# Altium project Flight_Controller_Board_Design.PrjPcb
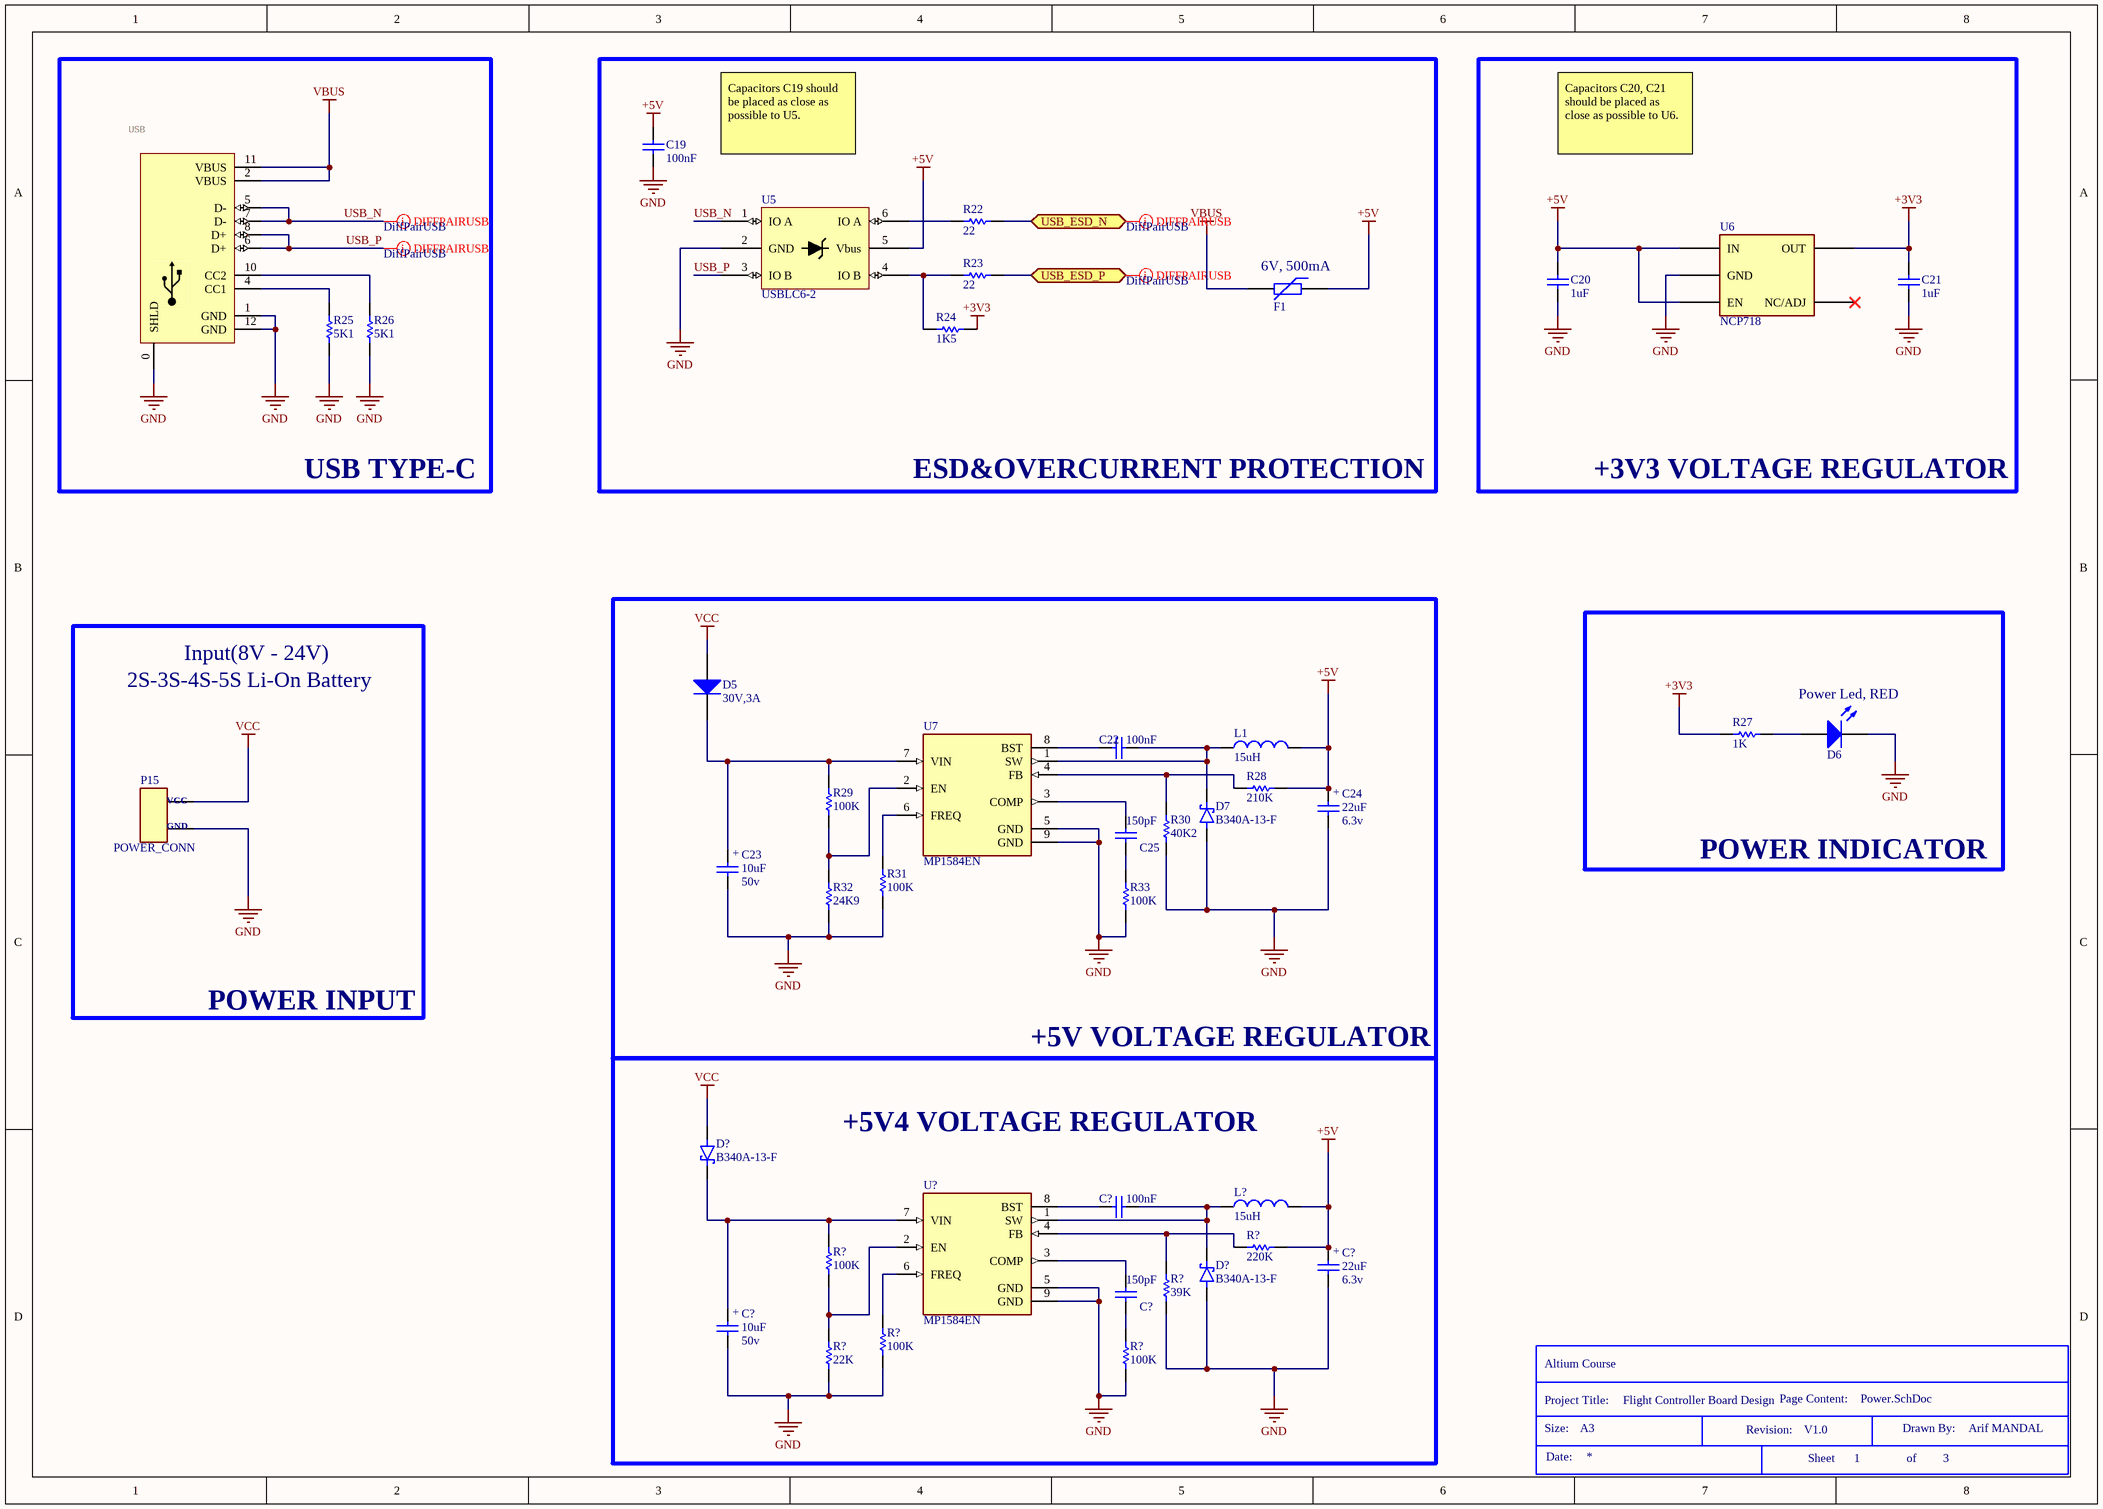
[diagram p0: Power.SchDoc]
NameProject: Flight Controller Board Design
3 sheets, 112 parts. Net scope: flat (ports and power ports of the same name join across sheets).
Board file: Flight_Controller_Board_Design.PcbDoc
Sheets:
  Power.SchDoc
  MicroController.SchDoc
  Modules.SchDoc

## Sheet Power.SchDoc
size A3; DocumentNumber: 1; Revision: V1.0; SheetNumber: 1; SheetTotal: 3

### Parts
(Parts that share a designator on the sheet are numbered #1, #2 ... from top to bottom, then left to right.)
*#1  Size: A3  Drawn By: Arif MANDAL  (hidden comment: Title Block)  (graphical)
C19  100nF  [C805]
C20  1uF  [C805]
C21  1uF  [C805]
C22  100nF  [C805]
C23  Volte: 50v  [MY_SMC_A]  (hidden comment: 10uF)
C24  Volte: 6.3v  [MY_SMC_A]  (hidden comment: 22uF)
C25  150pF  [C805]
C?#1  100nF  [C805]
C?#2  Volte: 6.3v  [MY_SMC_A]  (hidden comment: 22uF)
C?#3  150pF  [C805]
C?#4  Volte: 50v  [MY_SMC_A]  (hidden comment: 10uF)
D5  30V,3A  [MY_1N4007_SMD]
D6  LED  [LED-1206]  (value not drawn)
D7  B340A-13-F  [DIOM5226X240N]
D?#1  B340A-13-F  [DIOM5226X240N]
D?#2  B340A-13-F  [DIOM5226X240N]
F1  500mA  [PTC-0805]  (value not drawn)
L1  15uH  [MY_DR73]
L?  15uH  [MY_DR73]
P15  POWER_CONN  [POWER_CONN]
R22  22  [R805]
R23  22  [R805]
R24  1K5  [R805]
R25  5K1  [R805]
R26  5K1  [R805]
R27  1K  [R805]
R28  210K  [R805]
R29  100K  [R805]
R30  40K2  [R805]
R31  100K  [R805]
R32  24K9  [R805]
R33  100K  [R805]
R?#1  220K  [R805]
R?#2  39K  [R805]
R?#3  100K  [R805]
R?#4  100K  [R805]
R?#5  22K  [R805]
R?#6  100K  [R805]
U5  USBLC6-2  [SOT-23-6]
U6  NCP718  [TSOT-23-5]
U7  MP1584EN  [SOIC127P-9N]
U?  MP1584EN  [SOIC127P-9N]
USB  USB_C  [USB-C-5]  (value not drawn)

### Blocks framed on the sheet
USB TYPE-C: R25 R26 USB
ESD&OVERCURRENT PROTECTION: C19 F1 R22-R24 U5
+3V3 VOLTAGE REGULATOR: C20 C21 U6
+5V VOLTAGE REGULATOR: C22-C25 D5 D7 L1 R28-R33 U7
POWER INPUT: P15
POWER INDICATOR: D6 R27

### Ports
USB_ESD_N (bidir), USB_ESD_P (bidir)

### Nets
+3V3: C21.2 R24.2 R27.1 U6.5(OUT)
+5V: C19.2 C20.2 C24.+ C?#2.+ F1.1 L1.2 L?.2 R28.1 R?#1.1 U5.5(Vbus) U6.1(IN) U6.3(EN)
GND: C19.1 C20.1 C21.1 C23.- C24.- C?#2.- C?#4.- D6.2(K) D7.A D?#2.A P15.1(GND) R25.1 R26.1 R30.2 R31.1 R32.1 R33.1 R?#2.2 R?#4.1 R?#5.1 R?#6.1 U5.2(GND) U6.2(GND) U7.5(GND) U7.9(GND) U?.5(GND) U?.9(GND) USB.0(SHLD) USB.1(GND) USB.12(GND)
VBUS: F1.2 USB.2(VBUS) USB.11(VBUS)
VCC: D5.A D?#1.A P15.0(VCC)
USB_N: U5.1(IO_A) USB.5(D-) USB.7(D-)
USB_P: U5.3(IO_B) USB.6(D+) USB.8(D+)
NetC22_1: C22.1 D7.C L1.1 U7.1(SW)
NetC22_2: C22.2 U7.8(BST)
NetC23_+: C23.+ D5.K R29.2 U7.7(VIN)
NetC25_1: C25.1 R33.2
NetC25_2: C25.2 U7.3(COMP)
NetC?#1_1: C?#1.1 D?#2.C L?.1 U?.1(SW)
NetC?#1_2: C?#1.2 U?.8(BST)
NetC?#3_1: C?#3.1 R?#6.2
NetC?#3_2: C?#3.2 U?.3(COMP)
NetC?#4_+: C?#4.+ D?#1.C R?#3.2 U?.7(VIN)
NetD6_1: D6.1(A) R27.2
NetR22_1: R22.1 ; port USB_ESD_N
NetR22_2: R22.2 U5.6(IO_A)
NetR23_1: R23.1 ; port USB_ESD_P
NetR23_2: R23.2 R24.1 U5.4(IO_B)
NetR25_2: R25.2 USB.4(CC1)
NetR26_2: R26.2 USB.10(CC2)
NetR28_2: R28.2 R30.1 U7.4(FB)
NetR29_1: R29.1 R32.2 U7.2(EN)
NetR31_2: R31.2 U7.6(FREQ)
NetR?#1_2: R?#1.2 R?#2.1 U?.4(FB)
NetR?#3_1: R?#3.1 R?#5.2 U?.2(EN)
NetR?#4_2: R?#4.2 U?.6(FREQ)

Not connected (* = marked no-connect by the designer): U6 4(NC/ADJ)*

### Layout directives
differential pair; differential pair class DiffPairUSB: NetR22_1, NetR23_1, USB_N, USB_P

### Notes on the sheet
- Capacitors C19 should be placed as close as possible to U5.
- Capacitors C20, C21 should be placed as close as possible to U6.
- (near F1) 6V, 500mA
- 2S-3S-4S-5S Li-On Battery
- Input(8V - 24V)
- Power Led, RED
- +5V4 VOLTAGE REGULATOR
- (in symbol Title Block) Altium Course; Project Title:; Page Content:; Size:; Revision:; Drawn By:; Date:; Sheet; of

### Library data of the parts
C19-C22 C25 C?#1 C?#3 = Cap: Capacitor; Designer: Parsa Malekpour
  C19 C22 C?#1: Value: 100nF
  C20 C21: Value: 1uF
  C25 C?#3: Value: 150pF
C23 C24 C?#2 C?#4 = Cap Pol: Polar capacitor; ASiD Part Number: C-AS
  C23 C?#4: Value: 10uF
  C24 C?#2: Value: 22uF
D5 = 1N4007: 1 Amp Diode; ASiD Part Number: 1n4007-AS
D7 D?#1 D?#2 = B340A-13-F: Diode, Rectifier, 3a, 40v, Do-214ac, Full Reel; Price: None; Value: *; MP: B340A-13-F; Package: None; Availability: Unavailable
F1 = PTC: Published: 24-Mar-1999; PackageVersion: Mar-2003; PackageReference: 6-0805
L1 L? = Inductor: ASiD Part Number: Inductor-AS; Current: 3.75A; Value: 15uH
P15 = POWER_CONN: Li-on Battery Power Connector
R22-R33 R?#1-R?#6 = Resistor: Designer: Parsa Malekpour
  R22 R23: Value: 22
  R24: Value: 1K5
  R25 R26: Value: 5K1
  R27: Value: 1K
  R28: Value: 210K
  R29 R31 R33 R?#3 R?#4 R?#6: Value: 100K
  R30: Value: 40K2
  R32: Value: 24K9
  R?#1: Value: 220K
  R?#2: Value: 39K
  R?#5: Value: 22K
U5 = USBLC6-2: Very low capacitance ESD protection
U6 = NCP718: Linear Voltage Regulator IC Positive Fixed 1 Output 300mA TSOT-23-5; Manu. Product Num.: NCP718BSN330T1G
U7 U? = MP1584EN: Buck Switching Regulator IC Positive Adjustable 0.8V 1 Output 3A 8-SOIC (0.154, 3.90mm Width) Exposed Pad; MF: Monolithic Power; Value: *; SnapEDA_Link: https://www.snapeda.com/parts/MP1584EN/Monolithic+Power+Systems+Inc./view-part/?ref=snap; MP: MP1584EN; Purchase-URL: https://pricing.snapeda.com/search/part/MP1584EN/?ref=eda; Check_prices: https://www.snapeda.com/parts/MP1584EN/Monolithic+Power+Systems+Inc./view-part/?ref=eda; Availability: In Stock; Price: None; Package: SOIC-8 Monolithic Power
USB = USB_C: USB Type C 16Pin Connector Super Speed pins not available on the 16-pin purely SMD connector so this part is best for USB 2.0 implementations. D1 and D2 are tied together enabling D+/- no matter which way the cable is plugged into the connector. The two channel configuration pins (CC1/2) are exposed. These are normally connected to ground via 5.1k resistors but can be reconfigured for high current/high power applications.; GateName_1: J1; SymbolName_1: USB-C-MINIMUM; DeviceName: 5; LibraryName: USBC; DeviceSetName: USB_C

## Sheet MicroController.SchDoc
size A3; DocumentNumber: 2; Revision: V1.0; SheetNumber: 2; SheetTotal: 3
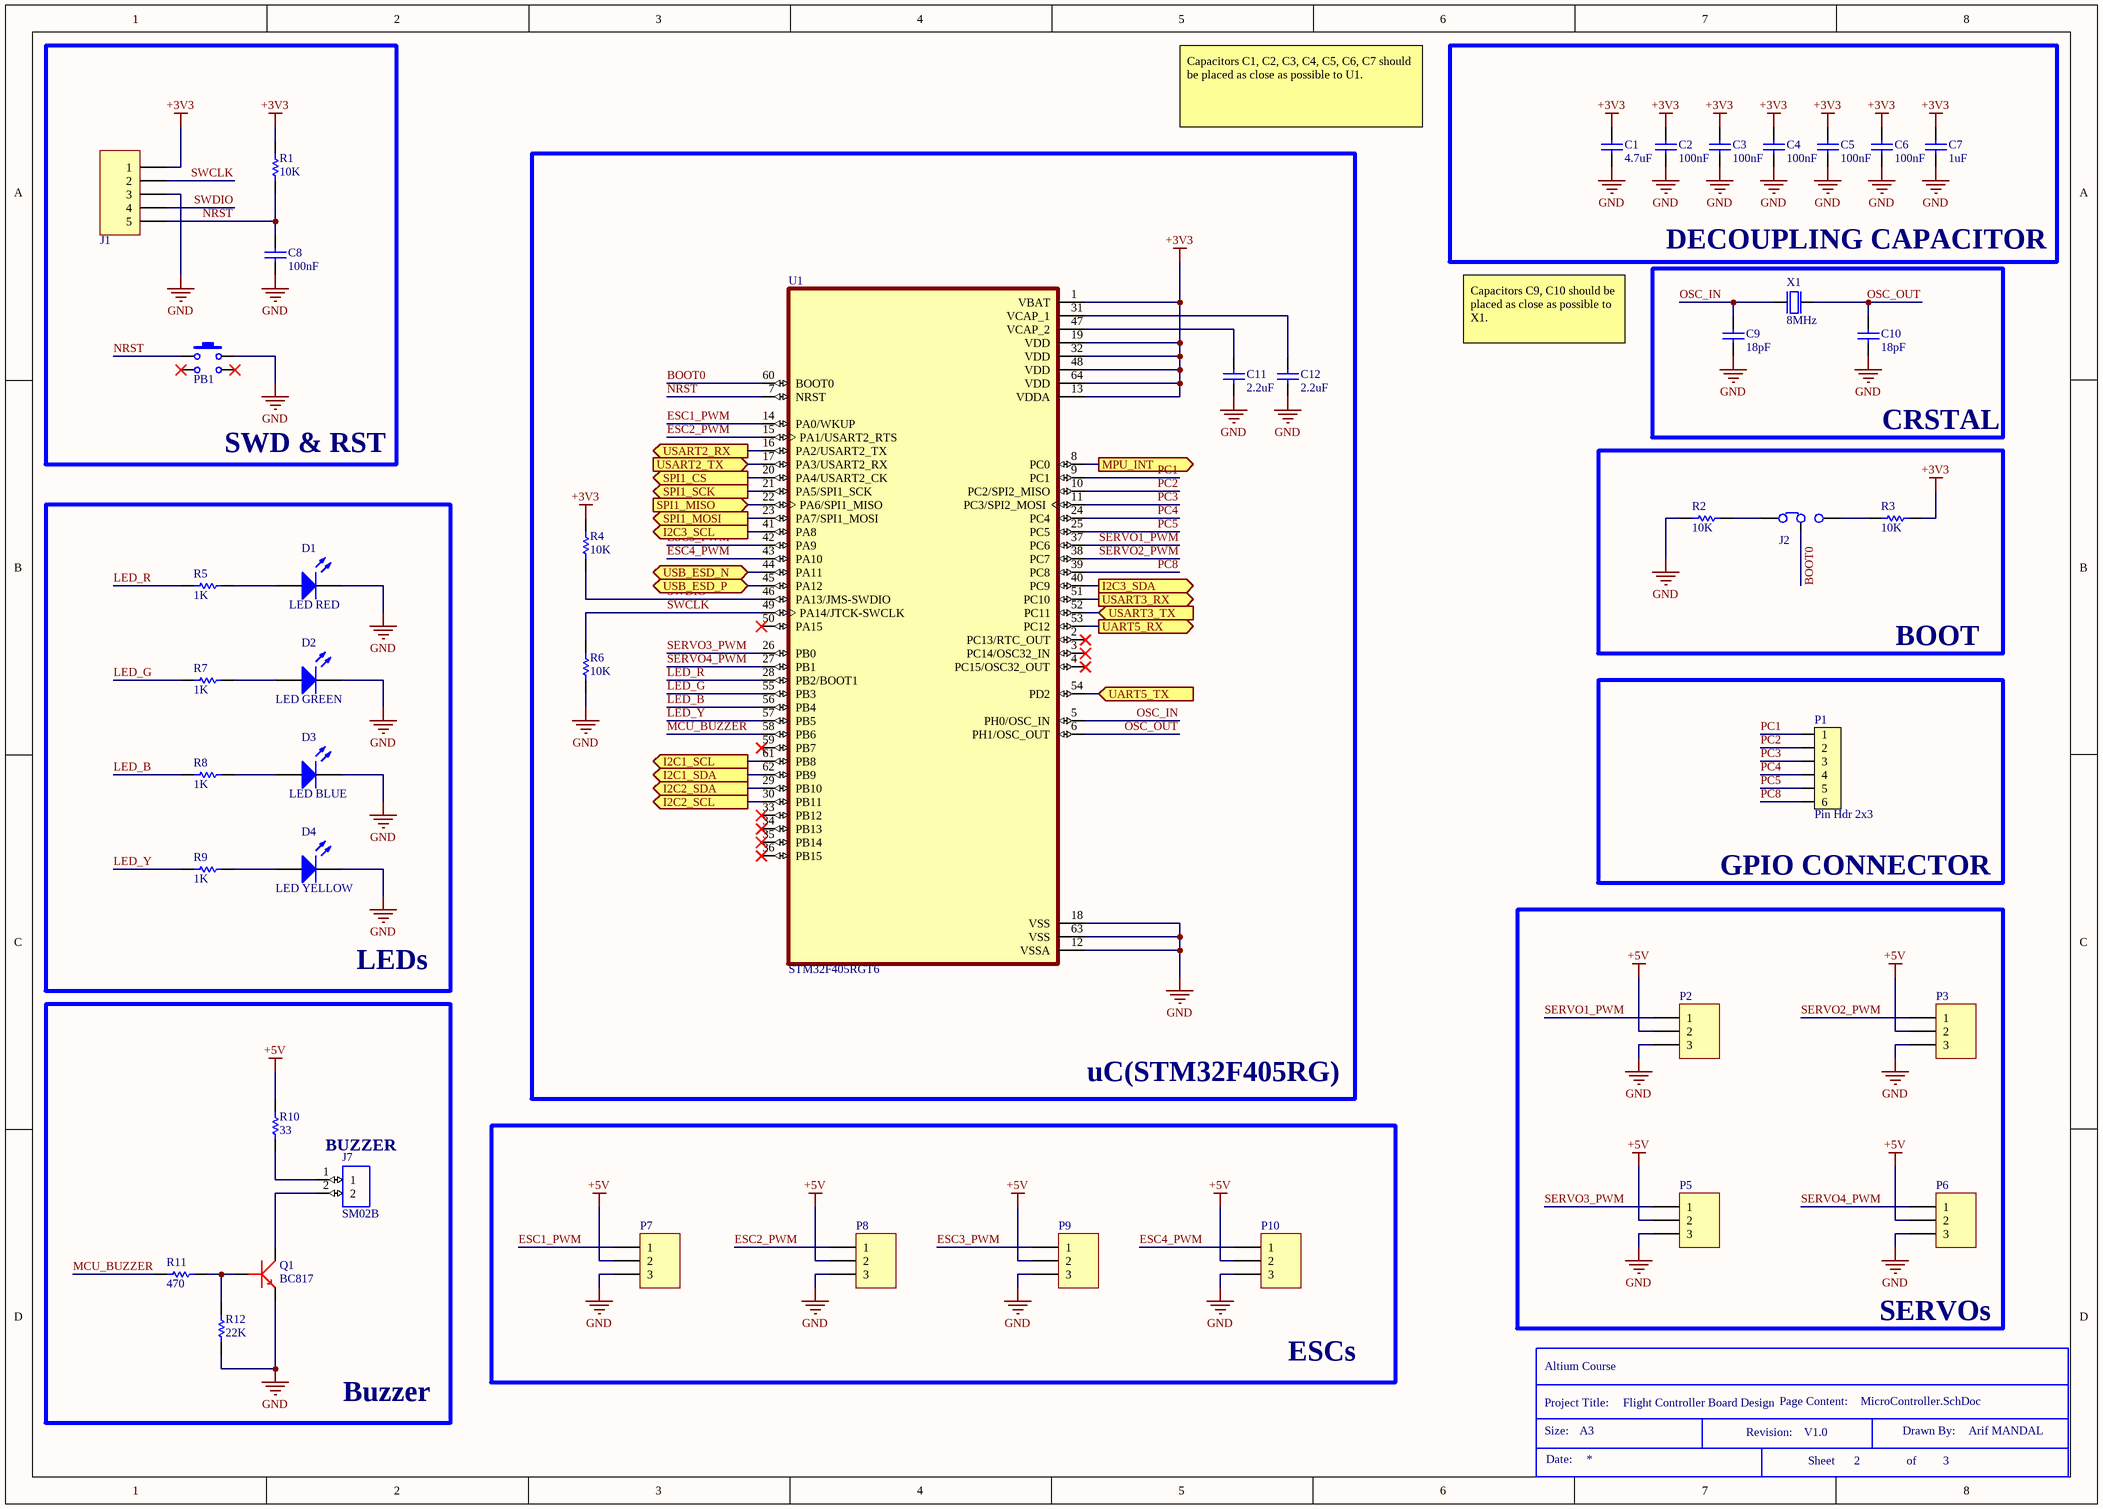
[diagram p1: MicroController.SchDoc]

### Parts
(Parts that share a designator on the sheet are numbered #1, #2 ... from top to bottom, then left to right.)
*#2  Size: A3  Drawn By: Arif MANDAL  (hidden comment: Title Block)  (graphical)
C1  4.7uF  [C805]
C2  100nF  [C805]
C3  100nF  [C805]
C4  100nF  [C805]
C5  100nF  [C805]
C6  100nF  [C805]
C7  1uF  [C805]
C8  100nF  [C805]
C9  18pF  [C805]
C10  18pF  [C805]
C11  2.2uF  [C805]
C12  2.2uF  [C805]
D1  LED RED  [MY_LED_0805]
D2  LED GREEN  [MY_LED_0805]
D3  LED BLUE  [MY_LED_0805]
D4  LED YELLOW  [MY_LED_0805]
J1  CONN-5  [PHDR5]  (value not drawn)
J2  jumper  [jumper-3]  (value not drawn)
J7  SM02B  [SM02B-SRSS-TB(LF)(SN)]
P1  Pin Hdr 2x3  [HDR_2x3-SMD]
P2  Header 3  [My_1X03]  (value not drawn)
P3  Header 3  [My_1X03]  (value not drawn)
P5  Header 3  [My_1X03]  (value not drawn)
P6  Header 3  [My_1X03]  (value not drawn)
P7  Header 3  [My_1X03]  (value not drawn)
P8  Header 3  [My_1X03]  (value not drawn)
P9  Header 3  [My_1X03]  (value not drawn)
P10  Header 3  [My_1X03]  (value not drawn)
PB1  Push Button  [PB-SMD-3]  (value not drawn)
Q1  BC817  [SOT23_3]
R1  10K  [R805]
R2  10K  [R805]
R3  10K  [R805]
R4  10K  [R805]
R5  1K  [R805]
R6  10K  [R805]
R7  1K  [R805]
R8  1K  [R805]
R9  1K  [R805]
R10  33  [R805]
R11  470  [R805]
R12  22K  [R805]
U1  STM32F405RGT6  [QFP-64N]
X1  8MHz  [BT-XTAL_2016]

### Blocks framed on the sheet
SWD & RST: C8 J1 PB1 R1
DECOUPLING CAPACITOR: C1-C7
uC(STM32F405RG): C11 C12 R4 R6 U1
LEDs: D1-D4 R5 R7-R9
GPIO CONNECTOR: P1
SERVOs: P2 P3 P5 P6
Buzzer: J7 Q1 R10-R12
ESCs: P7-P10

### Ports
I2C1_SCL (out), I2C1_SDA (out), I2C2_SCL (out), I2C2_SDA (out), I2C3_SCL (out), I2C3_SDA (out), MPU_INT (out), SPI1_CS (out), SPI1_MISO (in), SPI1_MOSI (out), SPI1_SCK (out), UART5_RX (out), UART5_TX (in), USART2_RX (out), USART2_TX (in), USART3_RX (out), USART3_TX (in), USB_ESD_N (bidir), USB_ESD_P (bidir)

### Nets
+3V3: C1.2 C2.2 C3.2 C4.2 C5.2 C6.2 C7.2 J1.1 R1.2 R3.1 R4.2 U1.1(VBAT) U1.13(VDDA) U1.19(VDD) U1.32(VDD) U1.48(VDD) U1.64(VDD)
+5V: P2.2 P3.2 P5.2 P6.2 P7.2 P8.2 P9.2 P10.2 R10.1
GND: C1.1 C2.1 C3.1 C4.1 C5.1 C6.1 C7.1 C8.1 C9.1 C10.1 C11.1 C12.1 D1.K D2.K D3.K D4.K J1.3 P2.3 P3.3 P5.3 P6.3 P7.3 P8.3 P9.3 P10.3 PB1.2 Q1.2(E) R2.2 R6.1 R12.2 U1.12(VSSA) U1.18(VSS) U1.63(VSS) X1.2(GND) X1.4(GND)
BOOT0: J2.2(C2) U1.60(BOOT0)
ESC1_PWM: P7.1 U1.14(PA0/WKUP)
ESC2_PWM: P8.1 U1.15(PA1/USART2_RTS)
ESC3_PWM: P9.1 U1.42(PA9)
ESC4_PWM: P10.1 U1.43(PA10)
LED_B: R8.2 U1.56(PB4)
LED_G: R7.2 U1.55(PB3)
LED_R: R5.2 U1.28(PB2/BOOT1)
LED_Y: R9.2 U1.57(PB5)
MCU_BUZZER: R11.2 U1.58(PB6)
NRST: C8.2 J1.5 PB1.1 R1.1 U1.7(NRST)
OSC_IN: C9.2 U1.5(PH0/OSC_IN) X1.1(inp)
OSC_OUT: C10.2 U1.6(PH1/OSC_OUT) X1.3(out)
PC1: P1.1 U1.9(PC1)
PC2: P1.2 U1.10(PC2/SPI2_MISO)
PC3: P1.3 U1.11(PC3/SPI2_MOSI)
PC4: P1.4 U1.24(PC4)
PC5: P1.5 U1.25(PC5)
PC8: P1.6 U1.39(PC8)
SERVO1_PWM: P2.1 U1.37(PC6)
SERVO2_PWM: P3.1 U1.38(PC7)
SERVO3_PWM: P5.1 U1.26(PB0)
SERVO4_PWM: P6.1 U1.27(PB1)
SWCLK: J1.2 R6.2 U1.49(PA14/JTCK-SWCLK)
SWDIO: J1.4 R4.1 U1.46(PA13/JMS-SWDIO)
NetC11_2: C11.2 U1.47(VCAP_2)
NetC12_2: C12.2 U1.31(VCAP_1)
NetD1_A: D1.A R5.1
NetD2_A: D2.A R7.1
NetD3_A: D3.A R8.1
NetD4_A: D4.A R9.1
NetJ2_1: J2.1(C1) R2.1
NetJ2_3: J2.3(C3) R3.2
NetJ3_2: U1.17(PA3/USART2_RX) ; port USART2_TX
NetJ3_3: U1.16(PA2/USART2_TX) ; port USART2_RX
NetJ4_2: U1.52(PC11) ; port USART3_TX
NetJ4_3: U1.51(PC10) ; port USART3_RX
NetJ5_2: U1.54(PD2) ; port UART5_TX
NetJ5_3: U1.53(PC12) ; port UART5_RX
NetJ6_2: U1.40(PC9) ; port I2C3_SDA
NetJ6_3: U1.41(PA8) ; port I2C3_SCL
NetJ7_1: J7.1 R10.2
NetJ7_2: J7.2 Q1.3(C)
NetQ1_1: Q1.1(B) R11.1 R12.1
NetR13_1: U1.62(PB9) ; port I2C1_SDA
NetR14_1: U1.61(PB8) ; port I2C1_SCL
NetR15_1: U1.29(PB10) ; port I2C2_SDA
NetR16_1: U1.30(PB11) ; port I2C2_SCL
NetR22_1: U1.44(PA11) ; port USB_ESD_N
NetR23_1: U1.45(PA12) ; port USB_ESD_P
NetU1_8: U1.8(PC0) ; port MPU_INT
NetU1_20: U1.20(PA4/USART2_CK) ; port SPI1_CS
NetU1_21: U1.21(PA5/SPI1_SCK) ; port SPI1_SCK
NetU1_22: U1.22(PA6/SPI1_MISO) ; port SPI1_MISO
NetU1_23: U1.23(PA7/SPI1_MOSI) ; port SPI1_MOSI

Not connected (* = marked no-connect by the designer): PB1 3* 4*; U1 2(PC13/RTC_OUT)* 3(PC14/OSC32_IN)* 4(PC15/OSC32_OUT)* 33(PB12)* 34(PB13)* 35(PB14)* 36(PB15)* 50(PA15)* 59(PB7)*

### Notes on the sheet
- Capacitors C1, C2, C3, C4, C5, C6, C7 should be placed as close as possible to U1.
- Capacitors C9, C10 should be placed as close as possible to X1.
- CRSTAL
- BOOT
- (near J7) BUZZER
- (in symbol Title Block) Altium Course; Project Title:; Page Content:; Size:; Drawn By:; Revision:; Date:; Sheet; of

### Library data of the parts
C1-C12 = Cap: Capacitor; Designer: Parsa Malekpour
  C1: Value: 4.7uF
  C2-C6 C8: Value: 100nF
  C7: Value: 1uF
  C9 C10: Value: 18pF
  C11 C12: Value: 2.2uF
D1-D4 = LED: Typical INFRARED GaAs LED; ASiD Part Number: LED-AS
J2 = Triple Jumper: Jumper wire
J7 = SM02B-SRSS-TB(LF)(SN): Connector Header Surface Mount, Right Angle 2 position 0.039 _1.00mm_; MP: SM02B-SRSS-TB_LF__SN_; MF: JST Sales; SnapEDA_Link: https://www.snapeda.com/parts/SM02B-SRSS-TB%28LF%29%28SN%29/JST%20Sales%20America%20Inc./view-part/447499/?ref=snap; Price: None; Value: *; Availability: Unavailable; Package: None
P1 = Pin Header 2x3 SMD: Pin Header 2x3, 2.54mm (100mil) SMD; Manufacturer: W-CON; Manufacturer Part Number: 1125-1203S0M116R1; Part number IPS: 00000009966; Artikkelnr Noca: 55010007; Pad Count: 6; Part Number: Pin Header 2x3 SMD; Footprint Doc: HDR_2x3-SMD; LatestRevisionDate: 2016-01-22; Published: 2016-01-22; Value: Pin Hdr 2x3; Note: SMD; ComponentLink1URL: N.A.; ComponentLink1Description: Datasheet; ComponentLink2URL: N.A.; ComponentLink2Description: Supplier link; HelpURL: \\hizz\pro\app9717\Datasheet\connectors\W-CON\1125-12XXXXMXXXXX.PDF; Supplier 1: Cabcon; Supplier Part Number 1: 1125-1203S0M116R1; Supplier 2: Samtec; Supplier Part Number 2: TSM-103-01-L-DV; Component Class: Connectors; PartId: 100500242
P2 P3 P5-P10 = Header 3: Header, 3-Pin; ASiD Part Number: Header 3-AS
PB1 = SWITCH-PB
Q1 = bc817-16
R1-R12 = Resistor: Designer: Parsa Malekpour
  R1-R4 R6: Value: 10K
  R5 R7-R9: Value: 1K
  R10: Value: 33
  R11: Value: 470
  R12: Value: 22K
U1 = STM32F405RGT6: High-performance foundation line, ARM Cortex-M4 core with DSP and FPU, 1 Mbyte Flash, 168 MHz CPU, ART Accelerator; MP: STM32F405RGT6; Value: *; Purchase Link: https://ozdisan.com/Product/Detail/492033/STM32F405RGT6V; Package: 64LQFP; Availability: Unavailable
X1 = XTAL_SMD2016_32MHz_8pF_Golledge: XTAL SMD 2016, 32MHz, Cl=8pF, Tol: ±10ppm, Stab: ±15ppm; Manufacturer Part Number: MP06003; Part number IPS: 00000001431; Note: XTAL SMD 32.000MHz; Artikkelnr Noca: 22010050; Pad Count: 4; Part Number: XTAL_SMD2016_32MHz_8pF_Golledge; LatestRevisionDate: 2016-11-02; Published: 2016-11-02; Value: 8MHz; Footprint Doc: XTAL_2016; Manufacturer: Golledge; ComponentLink1URL: N.A.; ComponentLink1Description: Datasheet; ComponentLink2URL: N.A.; ComponentLink2Description: Supplier link; HelpURL: \\hizz\pro\app9717\Datasheet\crystals\Golledge\mp06003.pdf; Supplier 1: Link Nordic; Supplier Part Number 1: N.A.; Supplier 2: N.A.; Supplier Part Number 2: N.A.; Component Class: Oscillators; PartId: 101600041

## Sheet Modules.SchDoc
size A3; DocumentNumber: 3; Revision: V1.0; SheetNumber: 3; SheetTotal: 3
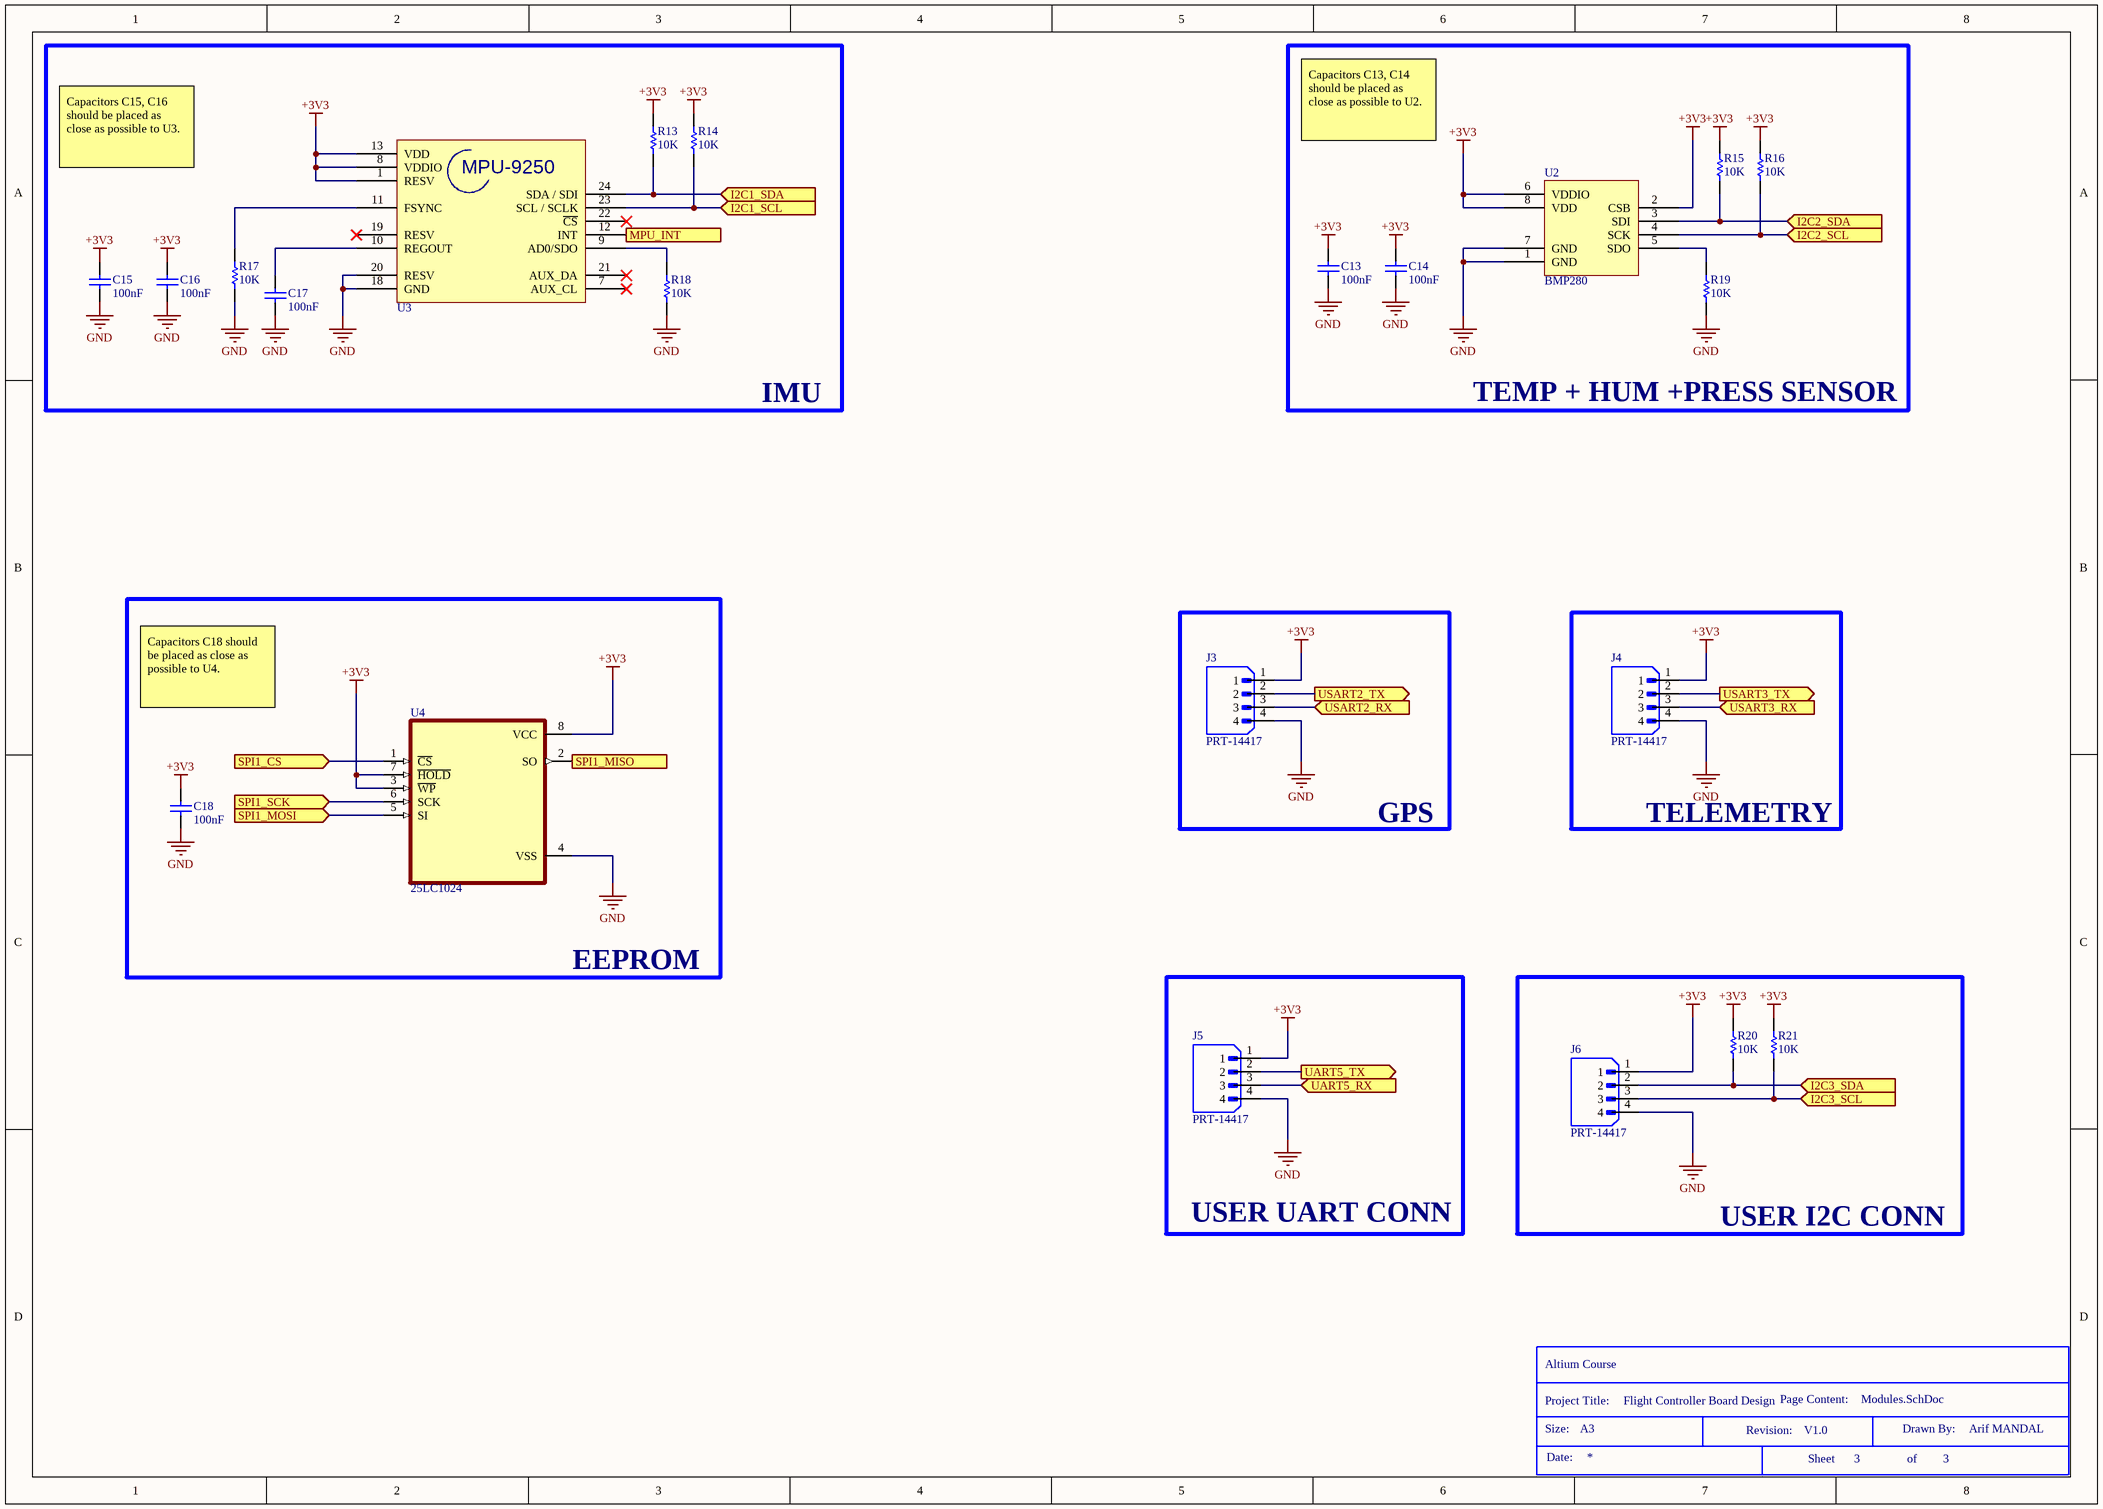
[diagram p2: Modules.SchDoc]

### Parts
(Parts that share a designator on the sheet are numbered #1, #2 ... from top to bottom, then left to right.)
*#3  Size: A3  Drawn By: Arif MANDAL  (hidden comment: Title Block)  (graphical)
C13  100nF  [C805]
C14  100nF  [C805]
C15  100nF  [C805]
C16  100nF  [C805]
C17  100nF  [C805]
C18  100nF  [C805]
J3  PRT-14417  [SPARKFUN_PRT-14417]
J4  PRT-14417  [SPARKFUN_PRT-14417]
J5  PRT-14417  [SPARKFUN_PRT-14417]
J6  PRT-14417  [SPARKFUN_PRT-14417]
R13  10K  [R805]
R14  10K  [R805]
R15  10K  [R805]
R16  10K  [R805]
R17  10K  [R805]
R18  10K  [R805]
R19  10K  [R805]
R20  10K  [R805]
R21  10K  [R805]
U2  BMP280  [BMP280]
U3  MPU-9250  [QFN-24]  (value not drawn)
U4  25LC1024  [SOIC-8N]

### Blocks framed on the sheet
IMU: C15-C17 R13 R14 R17 R18 U3
TEMP + HUM +PRESS SENSOR: C13 C14 R15 R16 R19 U2
EEPROM: C18 U4
GPS: J3
TELEMETRY: J4
USER UART CONN: J5
USER I2C CONN: J6 R20 R21

### Ports
I2C1_SCL (in), I2C1_SDA (in), I2C2_SCL (in), I2C2_SDA (in), I2C3_SCL (in), I2C3_SDA (in), MPU_INT (in), SPI1_CS (in), SPI1_MISO (out), SPI1_MOSI (in), SPI1_SCK (in), UART5_RX (in), UART5_TX (out), USART2_RX (in), USART2_TX (out), USART3_RX (in), USART3_TX (out)

### Nets
+3V3: C13.2 C14.2 C15.2 C16.2 C18.2 J3.1 J4.1 J5.1 J6.1 R13.2 R14.2 R15.2 R16.2 R20.2 R21.2 U2.2(CSB) U2.6(VDDIO) U2.8(VDD) U3.1(RESV) U3.8(VDDIO) U3.13(VDD) U4.3(~{WP}) U4.7(~{HOLD}) U4.8(VCC)
GND: C13.1 C14.1 C15.1 C16.1 C17.1 C18.1 J3.4 J4.4 J5.4 J6.4 R17.1 R18.1 R19.1 U2.1(GND) U2.7(GND) U3.18(GND) U3.20(RESV) U4.4(VSS)
NetC17_2: C17.2 U3.10(REGOUT)
NetJ3_2: J3.2 ; port USART2_TX
NetJ3_3: J3.3 ; port USART2_RX
NetJ4_2: J4.2 ; port USART3_TX
NetJ4_3: J4.3 ; port USART3_RX
NetJ5_2: J5.2 ; port UART5_TX
NetJ5_3: J5.3 ; port UART5_RX
NetJ6_2: J6.2 R20.1 ; port I2C3_SDA
NetJ6_3: J6.3 R21.1 ; port I2C3_SCL
NetR13_1: R13.1 U3.24(SDA_/_SDI) ; port I2C1_SDA
NetR14_1: R14.1 U3.23(SCL_/_SCLK) ; port I2C1_SCL
NetR15_1: R15.1 U2.3(SDI) ; port I2C2_SDA
NetR16_1: R16.1 U2.4(SCK) ; port I2C2_SCL
NetR17_2: R17.2 U3.11(FSYNC)
NetR18_2: R18.2 U3.9(AD0/SDO)
NetR19_2: R19.2 U2.5(SDO)
NetU1_8: U3.12(INT) ; port MPU_INT
NetU1_20: U4.1(~{CS}) ; port SPI1_CS
NetU1_21: U4.6(SCK) ; port SPI1_SCK
NetU1_22: U4.2(SO) ; port SPI1_MISO
NetU1_23: U4.5(SI) ; port SPI1_MOSI

Not connected (* = marked no-connect by the designer): U3 7(AUX_CL)* 19(RESV)* 21(AUX_DA)* 22(~{CS})*

### Notes on the sheet
- Capacitors C15, C16 should be placed as close as possible to U3.
- Capacitors C13, C14 should be placed as close as possible to U2.
- Capacitors C18 should be placed as close as possible to U4.
- (in symbol Title Block) Altium Course; Project Title:; Page Content:; Size:; Revision:; Drawn By:; Date:; Sheet; of

### Library data of the parts
C13-C18 = Cap: Capacitor; Designer: Parsa Malekpour; Value: 100nF
J3-J6 = PRT-14417: QWIIC JST CONNECTOR - SMD 4-PIN; MF: SparkFun Electronics; SnapEDA_Link: https://www.snapeda.com/parts/PRT-14417/SparkFun+Electronics/view-part/?ref=snap; Package: None; Value: *; MP: PRT-14417; Check_prices: https://www.snapeda.com/parts/PRT-14417/SparkFun+Electronics/view-part/?ref=eda
R13-R21 = Resistor: Designer: Parsa Malekpour; Value: 10K
U2 = BMP280: Digital Pressure Sensor
U4 = 25LC1024: EEPROM Memory IC 1Mb _128K x 8_ SPI 20MHz 8-SOIJ; MP: 25LC1024-I/SM; MF: Microchip; Price: None; SnapEDA_Link: https://www.snapeda.com/parts/25LC1024-I/SM/Microchip/view-part/223975/?ref=snap; Package: SOIC-8 Microchip; Value: *; Availability: Unavailable

## Nets that join several sheets
+3V3: Power (C21.2 R24.2 R27.1 U6.5), MicroController (17 pins), Modules (24 pins)
+5V: Power (12 pins), MicroController (9 pins)
GND: Power (30 pins), MicroController (35 pins), Modules (18 pins)
NetJ3_2: MicroController (U1.17), Modules (J3.2)
NetJ3_3: MicroController (U1.16), Modules (J3.3)
NetJ4_2: MicroController (U1.52), Modules (J4.2)
NetJ4_3: MicroController (U1.51), Modules (J4.3)
NetJ5_2: MicroController (U1.54), Modules (J5.2)
NetJ5_3: MicroController (U1.53), Modules (J5.3)
NetJ6_2: MicroController (U1.40), Modules (J6.2 R20.1)
NetJ6_3: MicroController (U1.41), Modules (J6.3 R21.1)
NetR13_1: MicroController (U1.62), Modules (R13.1 U3.24)
NetR14_1: MicroController (U1.61), Modules (R14.1 U3.23)
NetR15_1: MicroController (U1.29), Modules (R15.1 U2.3)
NetR16_1: MicroController (U1.30), Modules (R16.1 U2.4)
NetR22_1: Power (R22.1), MicroController (U1.44)
NetR23_1: Power (R23.1), MicroController (U1.45)
NetU1_8: MicroController (U1.8), Modules (U3.12)
NetU1_20: MicroController (U1.20), Modules (U4.1)
NetU1_21: MicroController (U1.21), Modules (U4.6)
NetU1_22: MicroController (U1.22), Modules (U4.2)
NetU1_23: MicroController (U1.23), Modules (U4.5)